# EAGLE design ESPblaster (EAGLE 8.1.1)
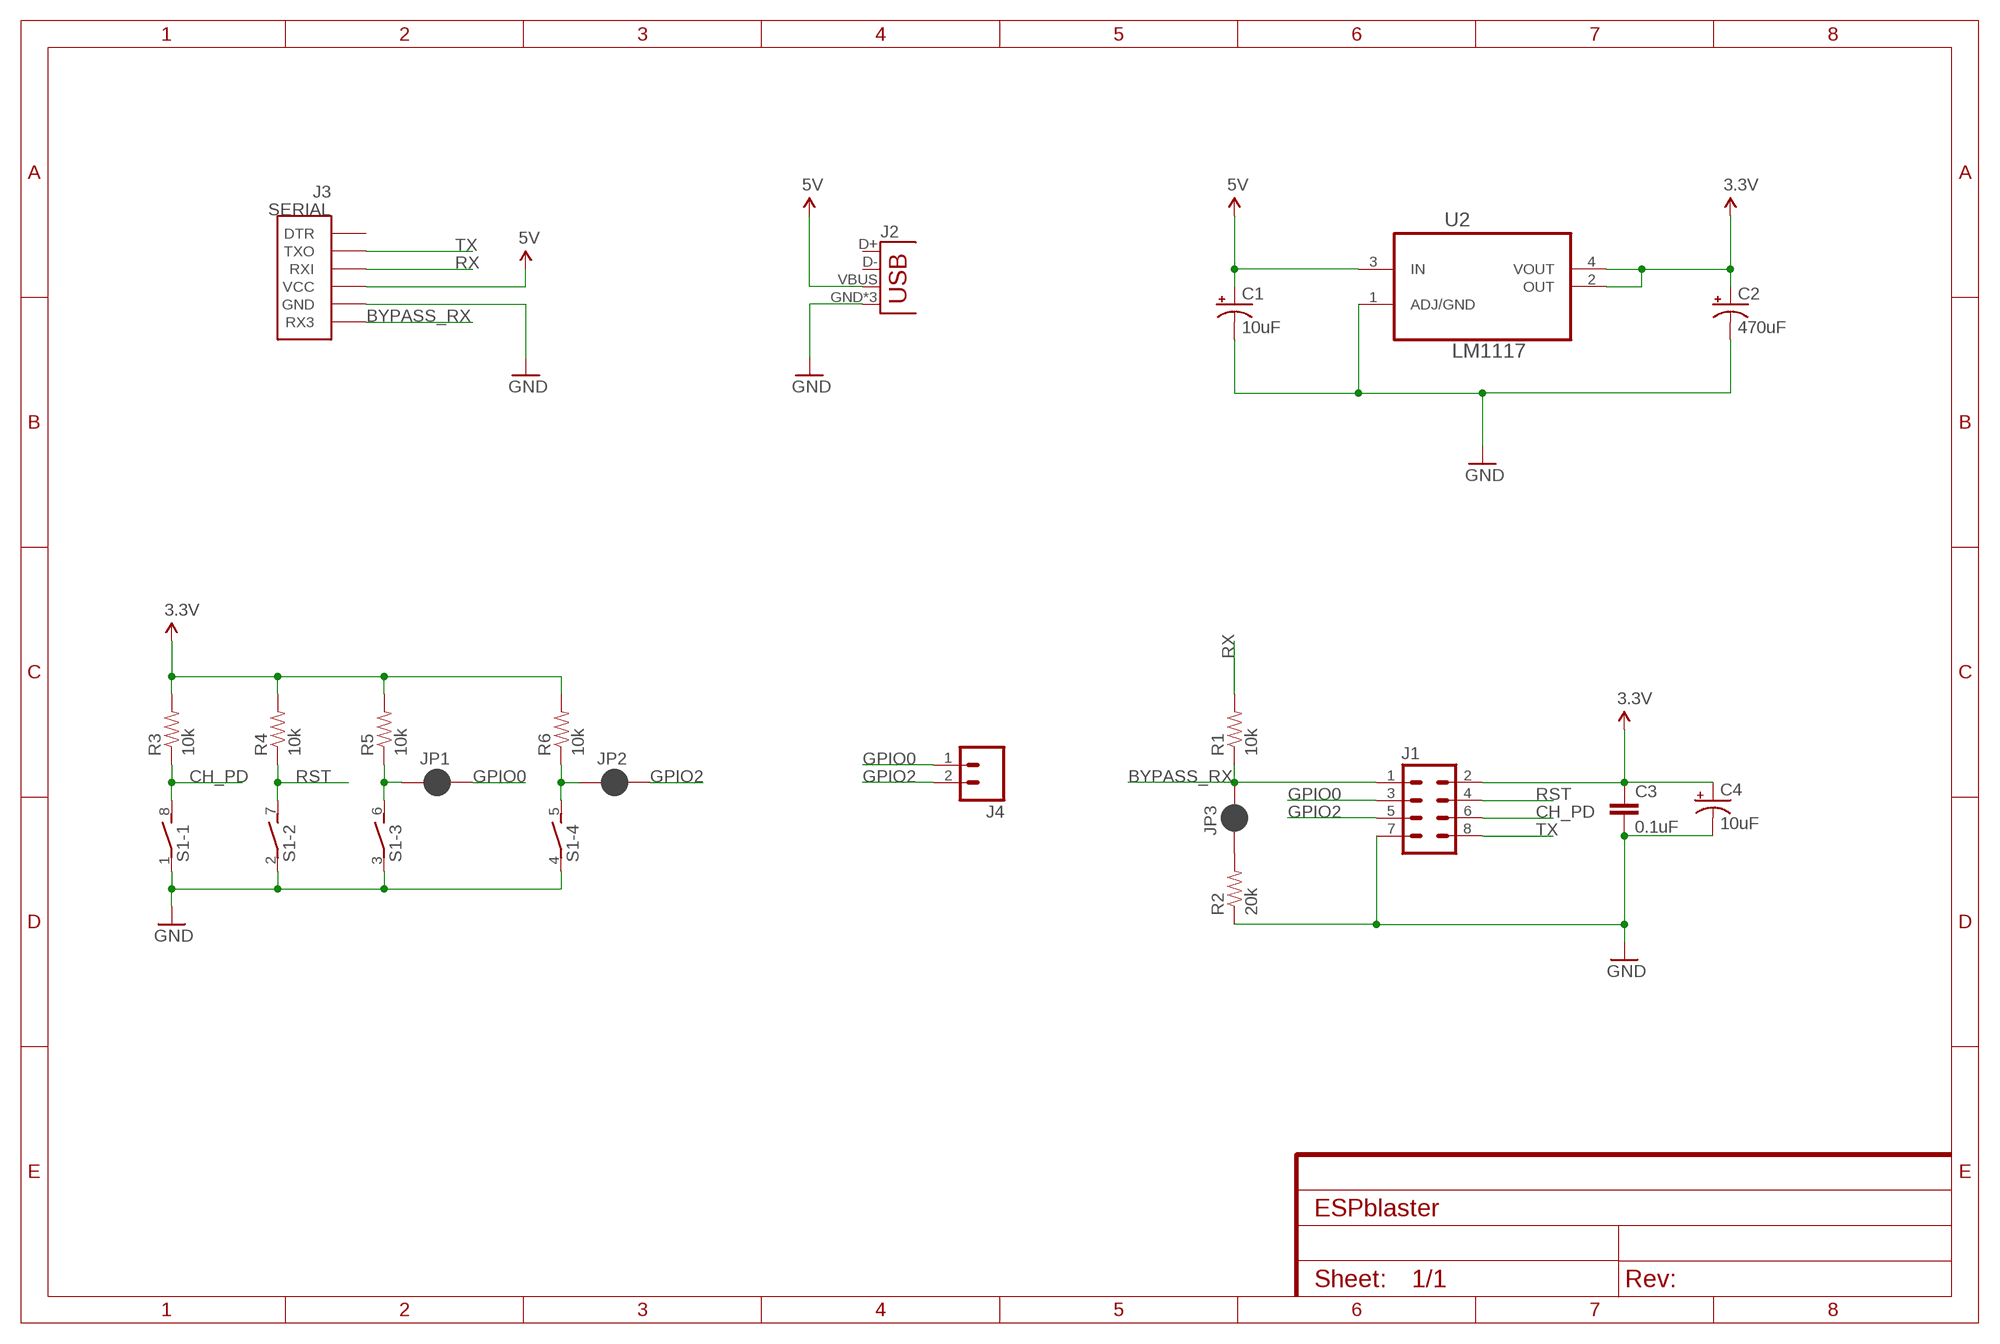
[diagram p0: schematic, sheet 1]
FRAME1 (FRAME-A4L): CNAME: ESP-01 Breakout; CREVISION: 1; DESIGNER: Pan Ziyue

## Parts
C1  10uF  CAP_POL1206-KIT  [EIA3216-KIT]
C2  470uF  CAP_POLPTH1  [CPOL-RADIAL-100UF-25V]
C3  0.1uF  CAP1206  [1206]
C4  10uF  CAP_POL1206-KIT  [EIA3216-KIT]
J1  M04X2  [2X4]
J2  USB-MICROB  [USB-MICROB]
J3  SERIAL  CP2102_DEVICE_ESP8266CP2  [CP2102_DEVICE_SIDE_ESP8266]
J4  M02LOCK  [1X02_LOCK]
JP1  JUMPER-PAD-2-NC_BY_PASTEFULL-BOX-SILK  [PAD-JUMPER-2-NC_BY_PASTE_YES_SILK_FULL_BOX]
JP2  JUMPER-PAD-2-NC_BY_PASTEFULL-BOX-SILK  [PAD-JUMPER-2-NC_BY_PASTE_YES_SILK_FULL_BOX]
JP3  JUMPER-PAD-2-NC_BY_PASTEFULL-BOX-SILK  [PAD-JUMPER-2-NC_BY_PASTE_YES_SILK_FULL_BOX]
R1  10k  RESISTOR1206  [1206]
R2  20k  RESISTOR1206  [1206]
R3  10k  RESISTOR1206  [1206]
R4  10k  RESISTOR1206  [1206]
R5  10k  RESISTOR1206  [1206]
R6  10k  RESISTOR1206  [1206]
S1  DIP04S  [DIP04S]
U2  LM1117  LM1117MP-3.3  [SOT230P696X180-4N]

## Nets
3.3V: C2.1(+) C3.1 C4.A(+) J1.2 R3.2 R4.2 R5.2 R6.2 U2.2(OUT) U2.4(VOUT)
5V: C1.A(+) J2.VBUS J3.P$4(VCC) U2.3(IN)
BYPASS_RX: J1.1 J3.P$6(RX3) JP3.2 R1.1
CH_PD: J1.6 R3.1 S1.8
GND: C1.C(-) C2.2(-) C3.2 C4.C(-) J1.7 J2.GND J2.MT1(GND) J2.MT2(GND) J3.P$5(GND) R2.1 S1.1 S1.2 S1.3 S1.4 U2.1(ADJ/GND)
GPIO0: J1.3 J4.1 JP1.2
GPIO2: J1.5 J4.2 JP2.2
N$1: JP3.1 R2.2
N$2: JP2.1 R6.1 S1.5
N$3: JP1.1 R5.1 S1.6
RST: J1.4 R4.1 S1.7
RX: J3.P$3(RXI) R1.2
TX: J1.8 J3.P$2(TXO)
Unconnected: J2.D+ J2.D- J3.P$1(DTR)

## Library data of the parts
C1 C2 C4 = SparkFun-Capacitors:CAP_POL: Capacitor Polarized These are standard SMD and PTH capacitors. Normally 10uF, 47uF, and 100uF in electrolytic and tantalum varieties. Always verify the external diameter of the through hole cap, it varies with capacity, voltage, and manufacturer. The EIA devices should be standard.
C3 = SparkFun-Capacitors:CAP: Capacitor Standard 0603 ceramic capacitor, and 0.1" leaded capacitor.
J1 = SparkFun-Connectors:M04X2: .1" header, two rows of four.
J2 = SparkFun-Connectors:USB: USB Connectors USB-B-PTH is fully proven SKU : PRT-00139/CONN-08278 USB-miniB is fully proven SKU : PRT-00587 USB-A-PCB is untested. USB-A-H is throughly reviewed, but untested. Spark Fun Electronics SKU : PRT-00437 USB-B-SMT is throughly reviewed, but untested. Needs silkscreen touching up. USB-A-S has not been used/tested USB-MB-H has not been used/tested USB-MICROB has been used. CONN-09505; PROD_ID: CONN-09505
J3 = SparkFun-Connectors:CP2102_DEVICE_ESP8266: Specially made device to mate with CP2102 with a ESP8266 breakout board
J4 = SparkFun-Connectors:M02: Standard 2-pin 0.1" header. Use with - straight break away headers ( PRT-00116) - right angle break away headers (PRT-00553) - swiss pins (PRT-00743) - machine pins (PRT-00117) - female headers (PRT-00115) Molex polarized connector foot print use with: PRT-08233 with associated crimp pins and housings. 2.54_SCREWTERM for use with PRT-10571. 3.5mm Screw Terminal footprints for PRT-08084 5mm Screw Terminal footprints for use with PRT-08432
JP1-JP3 = SparkFun-Passives:JUMPER-PAD-2-NC_BY_PASTE
R1-R6 = SparkFun-Resistors:RESISTOR: Resistor Basic schematic elements and footprints for 0603, 1206, and PTH resistors.
S1 = custom:DIP04S: DIL/CODE SWITCH; OC_FARNELL: unknown; OC_NEWARK: unknown
U2 = custom:LM1117MP-3.3: Linear regulators; MPN: LM1117MP-3.3; OC_FARNELL: 9778195; OC_NEWARK: 41K3470; PACKAGE: SOT223-3; SUPPLIER: NationalSemiconductor

## Board
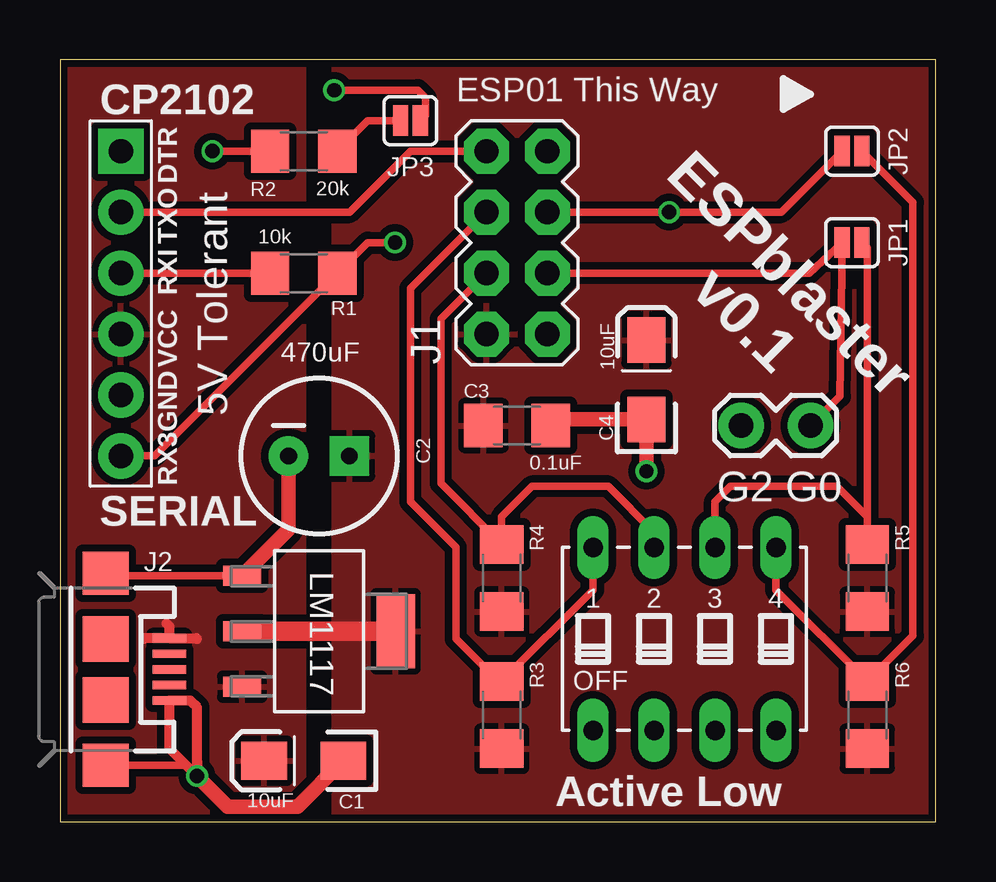
[diagram p1: board, top side]
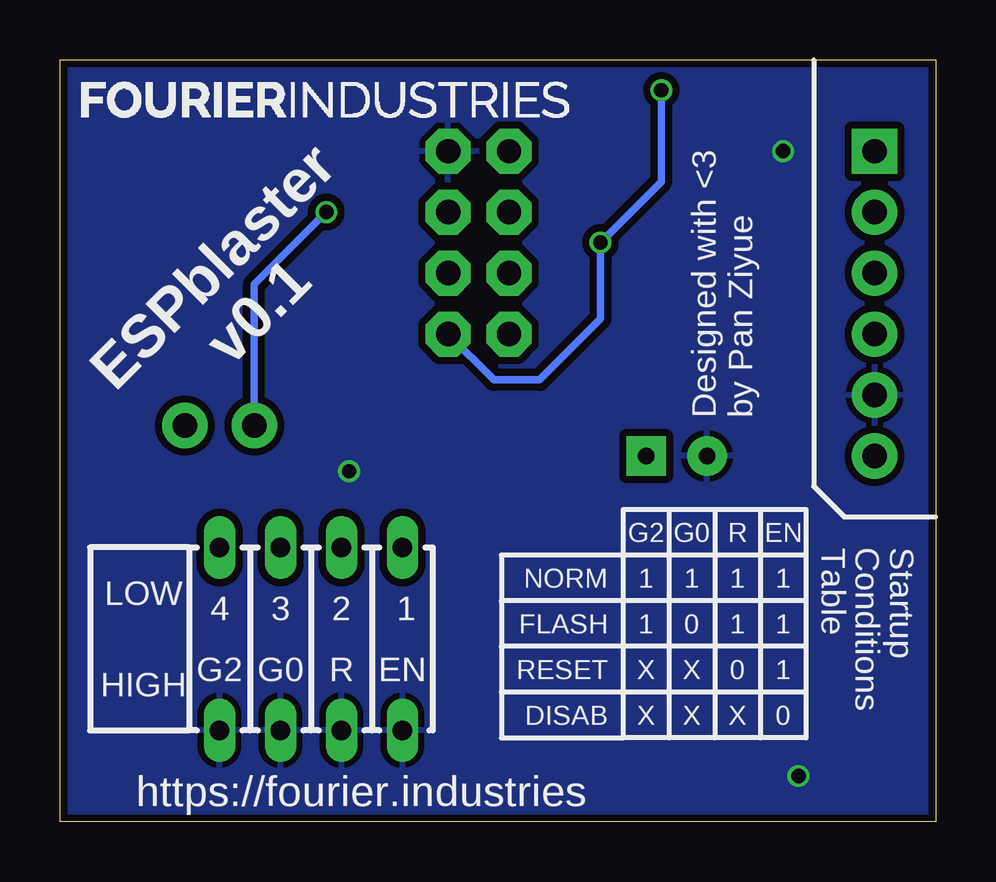
[diagram p2: board, bottom side, seen from below]

Size 36.5 x 31.74 mm. Coordinates in mm from the lower left corner, seen from the top.
Outline: 0,0 36.5,0 36.5,31.74 0,31.74 0,0
Copper layers (1*16): Top 0.035mm / dielectric 1.5mm / Bottom 0.035mm
Design rules "ITEADstudio_DRC": minimum track width 6mil, minimum drill 12mil, track to track 6mil, track to pad 6mil, pad to pad 6mil, via to via 6mil, smd to smd 0mil, copper to edge 10mil, drill to drill 10mil, minimum pad ring 10mil, minimum via ring 6mil, stop-mask expansion 2mil, vias tented up to drill 100mil, thermal gap 10mil

### Footprints (pad centres in the part's own frame; a part is rotated, then mirrored left to right if it is on the bottom)
EIA3216-KIT = smd 1.9 x 1.6: A 1.65,0; C -1.65,0
CPOL-RADIAL-100UF-25V = drill 0.7 pad 1.651 square: 1 1.27,0 | drill 0.7 pad 1.651: 2 -1.27,0
1206 = smd 1.6 x 1.8: 1 -1.4,0; 2 1.4,0
2X4 = drill 1.016 pad 1.88 octagon: 1 -3.81,-1.27; 2 -3.81,1.27; 3 -1.27,-1.27; 4 -1.27,1.27; 5 1.27,-1.27; 6 1.27,1.27; 7 3.81,-1.27; 8 3.81,1.27
USB-MICROB = smd 0.35 x 1.4: D+ 0,2.65; D- -0.65,2.65; GND 1.3,2.65; ID 0.65,2.65; VBUS -1.3,2.65 | smd 1.8 x 1.9: MT1 -4,0; MT2 4,0 | smd 1.9 x 1.9: P$1 -1.27,0; P$2 1.27,0
CP2102_DEVICE_SIDE_ESP8266 = drill 1.016 pad 1.88 square: P$1 -6.35,0 | drill 1.016 pad 1.88: P$2 -3.81,0; P$3 -1.27,0; P$4 1.27,0; P$5 3.81,0; P$6 6.35,0
1X02_LOCK = drill 1.016 pad 1.88: 1 -0.178,0; 2 2.718,0
PAD-JUMPER-2-NC_BY_PASTE_YES_SILK_FULL_BOX = smd 0.635 x 1.27: 1 -0.412,0; 2 0.412,0
DIP04S = drill 0.813 long: 1 -3.81,-3.81; 2 -1.27,-3.81; 3 1.27,-3.81; 4 3.81,-3.81; 5 3.81,3.81; 6 1.27,3.81; 7 -1.27,3.81; 8 -3.81,3.81
SOT230P696X180-4N = smd 1.6 x 0.838: 1 -3.2,2.311; 2 -3.2,0; 3 -3.2,-2.311 | smd 1.6 x 3.099: 4 3.2,0

### Placement (x,y rotation side)
C1  10.16,2.54 180 top
C2  10.79,15.24 0 top
C3  19.05,16.51 0 top
C4  24.45,18.41 90 top
J1  19.05,24.13 90 top
J2  1.91,6.35 270 top
J3  2.54,21.59 270 top
J4  31.11,16.51 180 top
JP1  33.02,24.13 180 top
JP2  33.02,27.94 180 top
JP3  14.61,29.21 0 top
R1  10.16,22.86 180 top
R2  10.16,27.94 0 top
R3  18.41,4.45 270 top
R4  18.41,10.16 270 top
R5  33.66,10.16 270 top
R6  33.66,4.45 270 top
S1  26.04,7.62 0 top
U2  10.79,7.94 0 top
U$1  [FOURIERINDUSTRIES-SMALL-INV]  35.72,28.89 0 top

### Tracks (layer width: path | path; a pad name or v marks a point on that pad's centre or on a via)
3.3V
  Top 0.813: U2.2 U2.4
  pour Top (isolate 0.305): 36.83,0 36.83,31.75 11.43,31.75 11.43,0
5V
  Top 0.406: J2.VBUS 4.55,8.14 4.45,8.26 | J2.VBUS 5.68,7.65 5.71,7.62 | J2.VBUS 3.52,7.65 3.49,7.62
  pour Top (isolate 0.305): 0,0 10.16,0 10.16,31.75 0,31.75
BYPASS_RX  (via drill 0.6)
  Top 0.305: J3.P$6 3.94,15.24 R1.1 12.83,24.13 v13.97,24.13 | v11.43,30.48 14.92,30.48 15.24,30.16 15.24,29.43 JP3.2
  Bottom 0.305: v11.43,30.48 11.43,26.67 v13.97,24.13 13.97,20.95 16.51,18.41 18.41,18.41 J1.1
CH_PD
  Top 0.305: S1.8 22.23,9.65 R3.1 18.29,5.84 16.51,7.62 16.51,11.43 14.61,13.34 14.61,22.23 J1.6
GND  (via drill 0.6)
  Top 0.305: R2.1 v6.35,27.94 | U2.1 2.01,10.25 | J2.MT2 5.27,2.35
  Top 0.406: v5.71,1.91 5.71,2.54 | 5.71,2.54 5.71,4.76 5.43,5.05 J2.GND 4.55,3.06 v5.71,1.91 | 5.27,2.35 v5.71,1.91 | 5.71,2.54 v5.71,1.91
  Top 0.61: 1.95,2.3 J2.MT2 | C2.2 9.53,12.18 U2.1 | 20.45,16 C3.2 20.7,16.77 C4.C v24.45,14.61 | v5.71,1.91 6.99,0.64 9.9,0.64 C1.C
  Top 0.813: J2.MT1 2.01,10.25
  pour Bottom (isolate 0.305): 0,0 36.83,0 36.83,31.75 0,31.75
GPIO0
  Top 0.305: J1.3 31.24,22.86 JP1.2 32.51,17.73 J4.1
GPIO2  (via drill 0.6)
  Top 0.305: J1.5 v25.4,25.4 30.07,25.4 JP2.2
  Bottom 0.305: J4.2 28.4,22.4 v25.4,25.4
N$1
  Top 0.305: JP3.1 12.83,29.21 R2.2
N$2
  Top 0.305: S1.5 29.84,9.65 R6.1 35.56,7.75 35.56,25.81 JP2.1
N$3
  Top 0.305: S1.6 27.3,13.34 27.94,13.97 32.38,13.97 33.66,12.7 R5.1 33.66,23.91 JP1.1
RST
  Top 0.305: J1.4 15.88,20.95 15.88,14.1 R4.1 18.41,12.7 19.68,13.97 22.86,13.97 24.77,12.06 S1.7
RX
  Top 0.305: J3.P$3 R1.2
TX
  Top 0.305: J1.8 14.61,27.94 12.06,25.4 J3.P$2

### Text on the board
tPlace: ESP01 This Way | 5V Tolerant | ESPblaster / v0.1 | G2 | G0 | Active Low
bPlace: ESPblaster / v0.1 | Designed with <3 / by Pan Ziyue | EN | R | G0 | G2 | Startup / Conditions / Table | 1 | 1 | 1 | 1 | NORM | LOW | 1 | 2 | 3 | 4 | 1 | 1 | 0 | 1 | FLASH | 1 | 0 | X | X | RESET | EN | R | G0 | G2 | HIGH | 0 | X | X | X | DISAB | https://fourier.industries